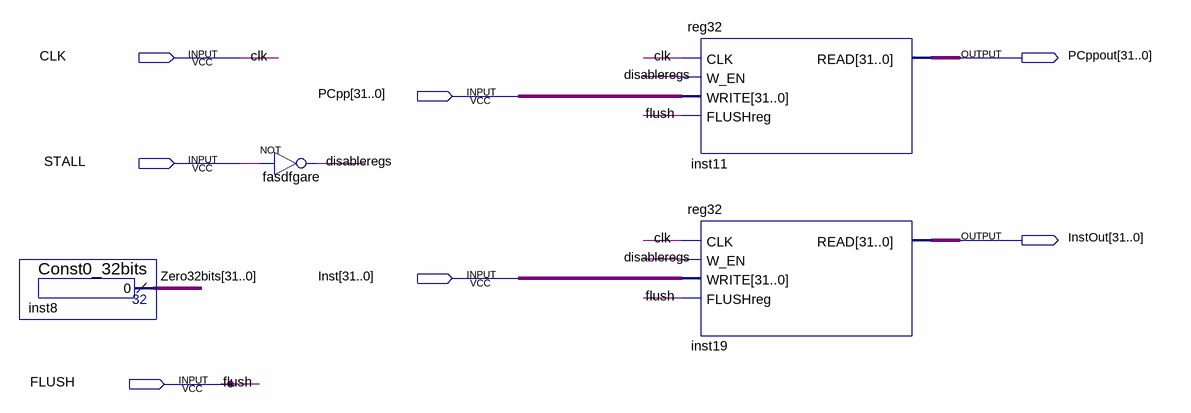
[diagram p0: schematic sheet]
// Quartus schematic IF-ID_barrier.bdf as structural Verilog: 4 symbols, 7 pins
module \IF-ID_barrier  (
  input  CLK,
  input  [31:0] PCpp,
  input  STALL,
  input  [31:0] Inst,
  input  FLUSH,
  output [31:0] PCppout,
  output [31:0] InstOut
);

  wire disableregs;
  wire [31:0] Zero32bits;

  Const0_32bits inst8 (.result(Zero32bits));
  not fasdfgare (disableregs, STALL);
  reg32 inst11 (.CLK(CLK), .W_EN(disableregs), .WRITE(PCpp), .FLUSHreg(FLUSH), .READ(PCppout));
  reg32 inst19 (.CLK(CLK), .W_EN(disableregs), .WRITE(Inst), .FLUSHreg(FLUSH), .READ(InstOut));
endmodule
